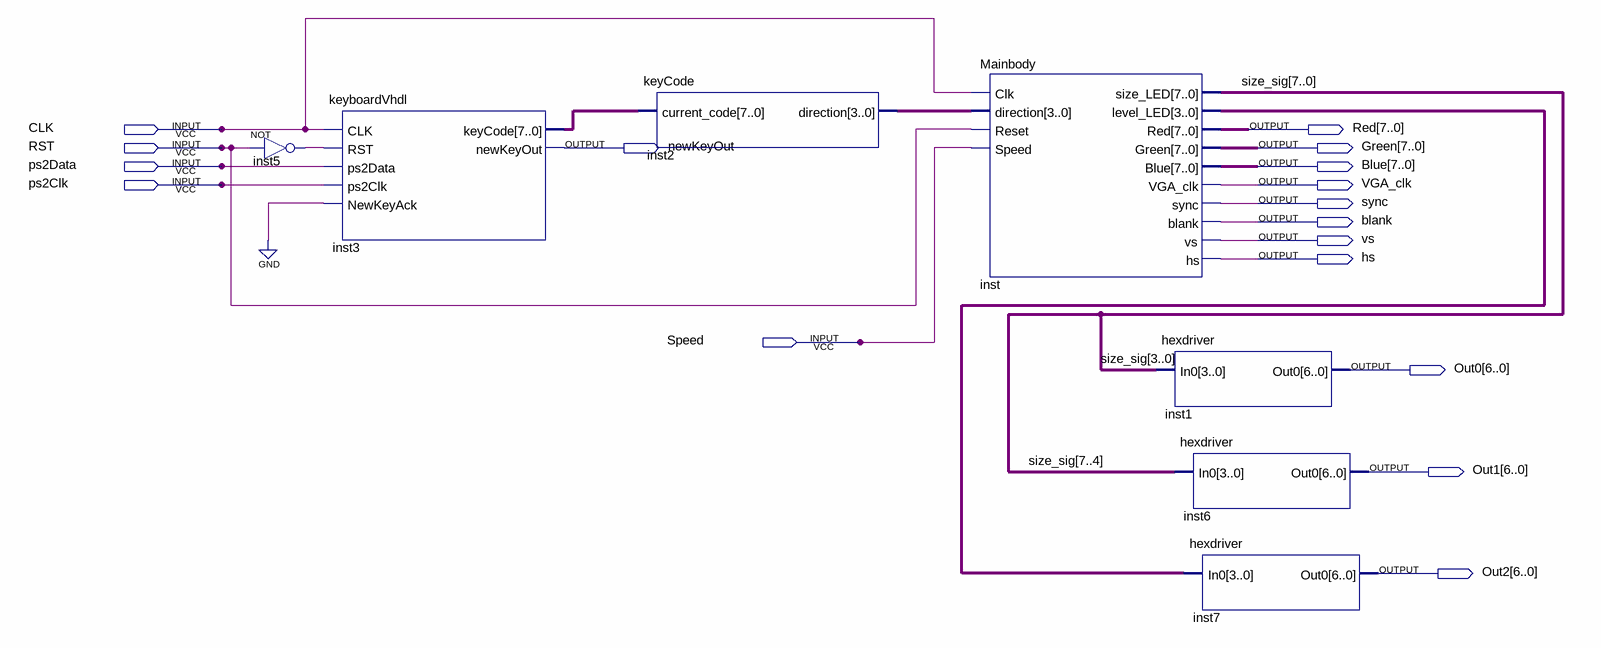
[diagram p0: schematic sheet]
// Quartus schematic Snake.bdf as structural Verilog: 7 symbols, 17 pins
module Snake (
  input  CLK,
  input  RST,
  input  ps2Data,
  input  ps2Clk,
  input  Speed,
  output [7:0] Red,
  output newKeyOut,
  output [7:0] Green,
  output [7:0] Blue,
  output VGA_clk,
  output sync,
  output blank,
  output vs,
  output hs,
  output [6:0] Out0,
  output [6:0] Out1,
  output [6:0] Out2
);

  wire inst5_out;
  wire [3:0] inst2_direction, inst_level_led;
  wire [7:0] inst3_keycode, size_sig;

  not inst5 (inst5_out, RST);
  keyboardVhdl inst3 (
    .CLK(CLK), .RST(inst5_out), .ps2Data(ps2Data), .ps2Clk(ps2Clk), .NewKeyAck(1'b0),
    .keyCode(inst3_keycode), .newKeyOut(newKeyOut));
  keyCode inst2 (.current_code(inst3_keycode), .direction(inst2_direction));
  Mainbody inst (
    .Clk(CLK), .direction(inst2_direction), .Reset(RST), .Speed(Speed), .size_LED(size_sig),
    .level_LED(inst_level_led), .Red(Red), .Green(Green), .Blue(Blue), .VGA_clk(VGA_clk), .sync(sync),
    .blank(blank), .vs(vs), .hs(hs));
  hexdriver inst1 (.In0(size_sig[3:0]), .Out0(Out0));
  hexdriver inst6 (.In0(size_sig[7:4]), .Out0(Out1));
  hexdriver inst7 (.In0(inst_level_led), .Out0(Out2));
endmodule
